# Altium schematic sheet template.SchDoc
size 840 x 594 mm; Address1: Address1; Address2: Address2; Address3: Address3; Address4: Address4; SheetNumber: 1; Scale: 1:1; Разраб.: Иванов; Обозначение документа: АБВГ.123456.001 Э3; Пров.: Петров; Утв.: Сидоров; Наименование организации: ОАО "Концерн "МПО-Гидроприбор"; Перв. применение: АБВГ.123456.000; Наименование изделия 1: Плата; Наименование изделия 2: Схема электрическая; Наименование изделия 3: принципиальная; Нач. отд.: Нач. отд.; Фамилия нач. отд.: Сидоров
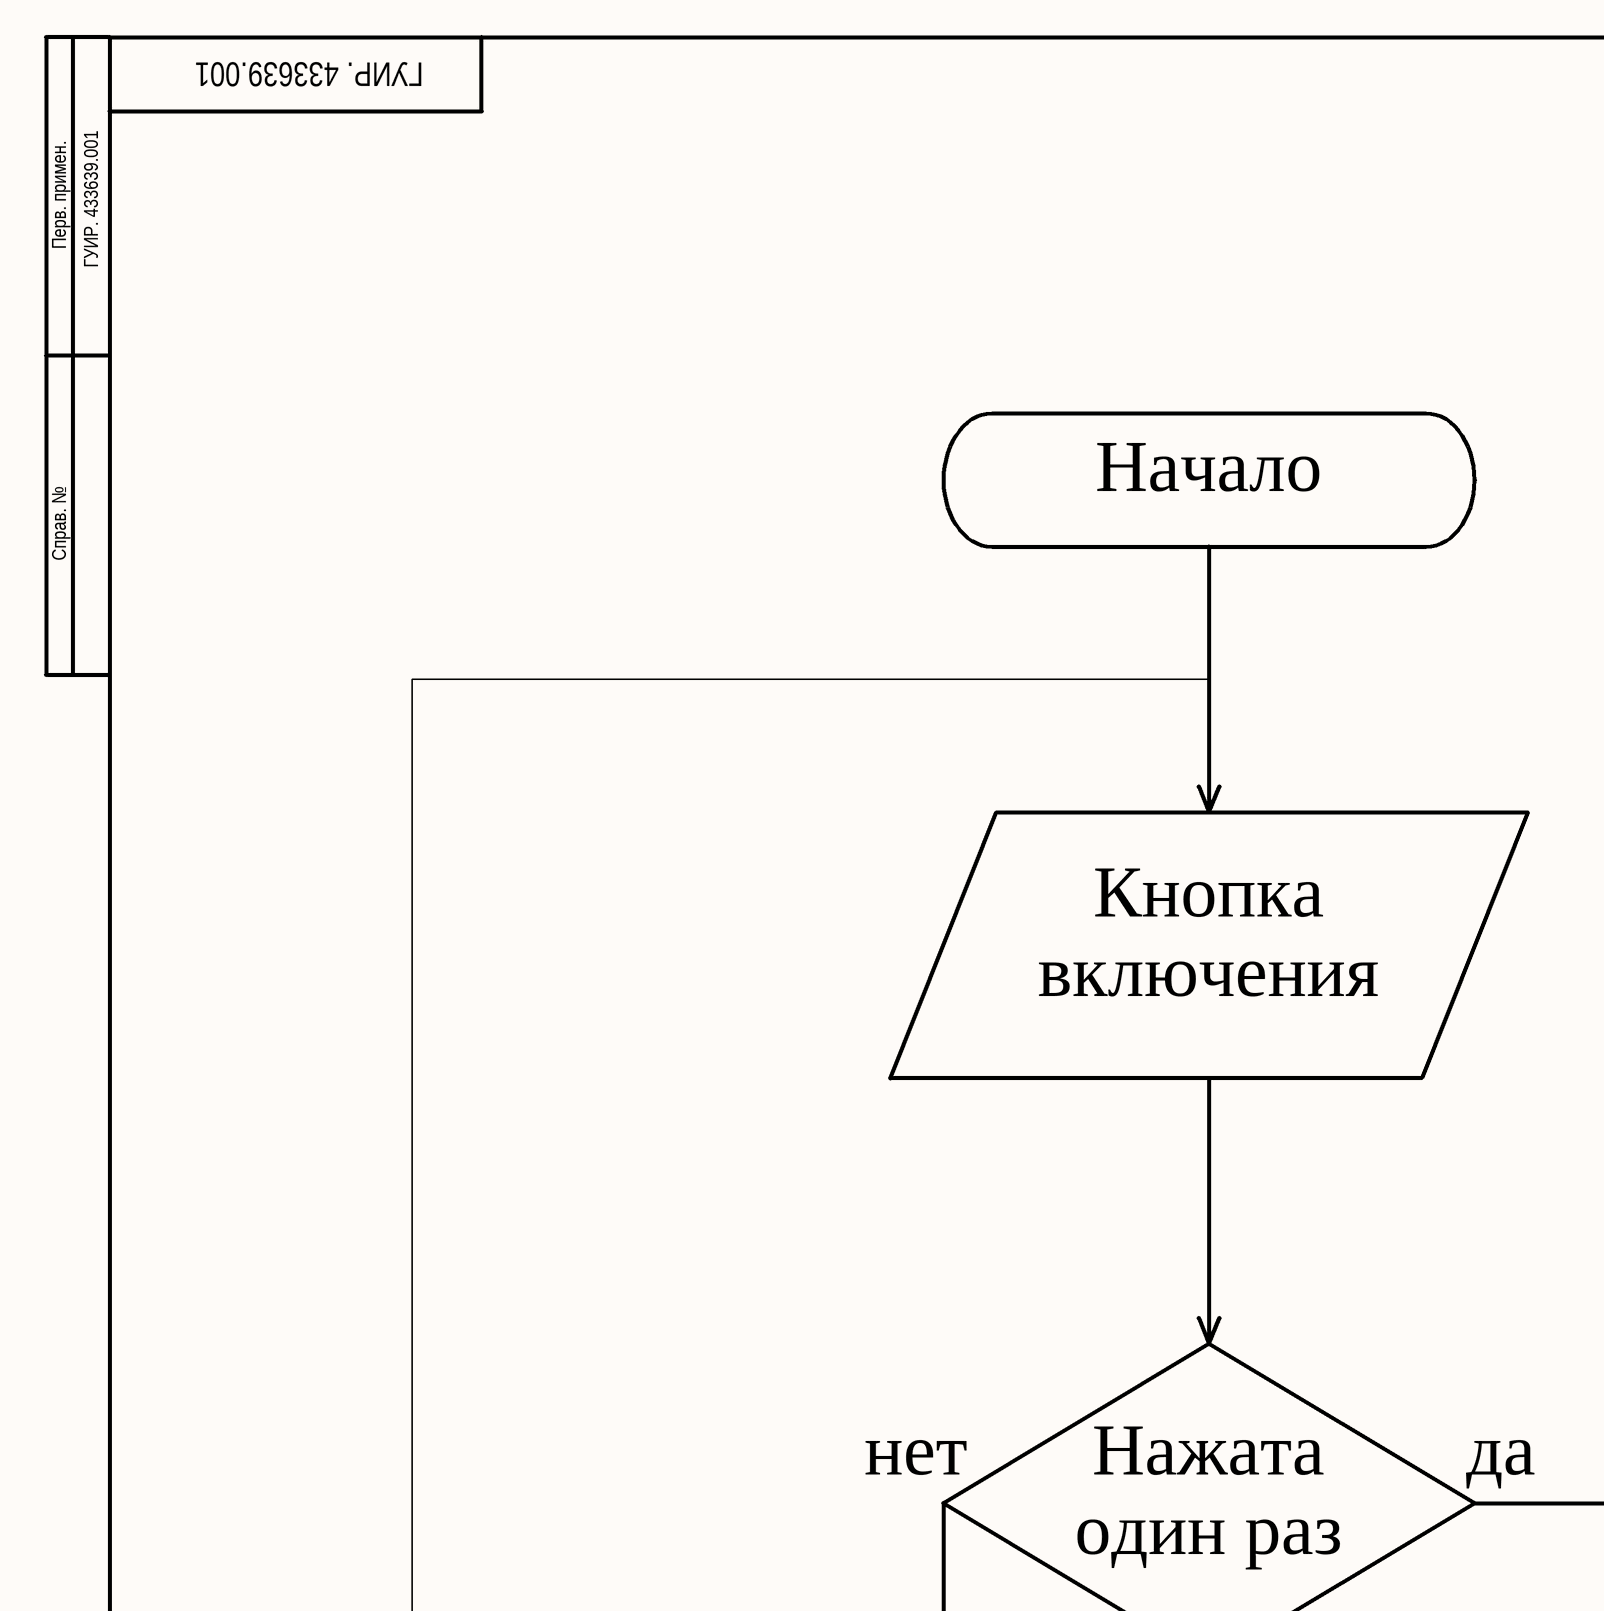
[diagram p0: template.SchDoc, top left]
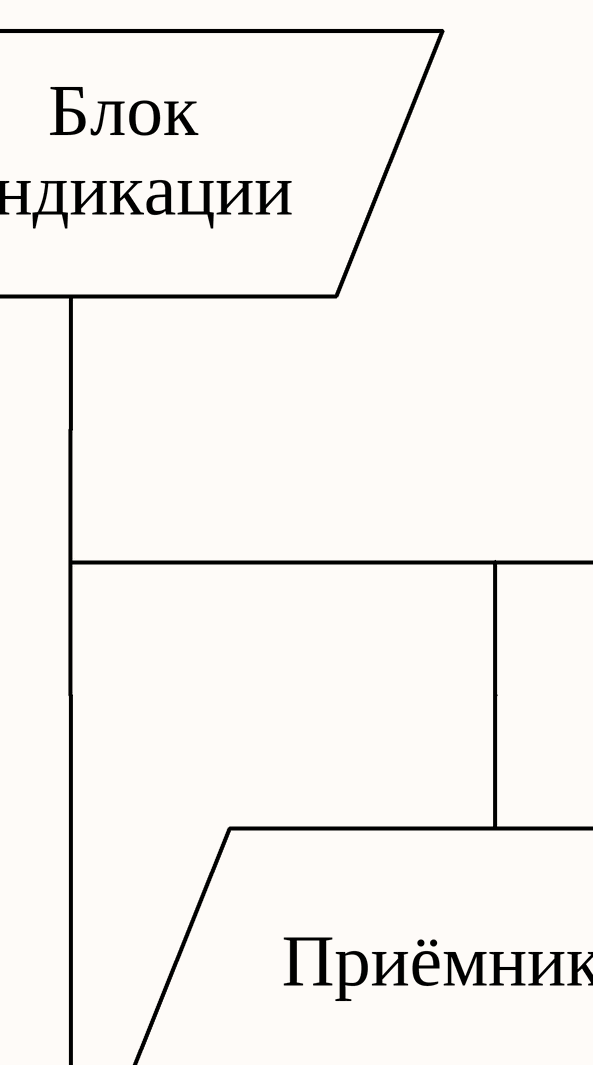
[diagram p1: template.SchDoc, top middle]
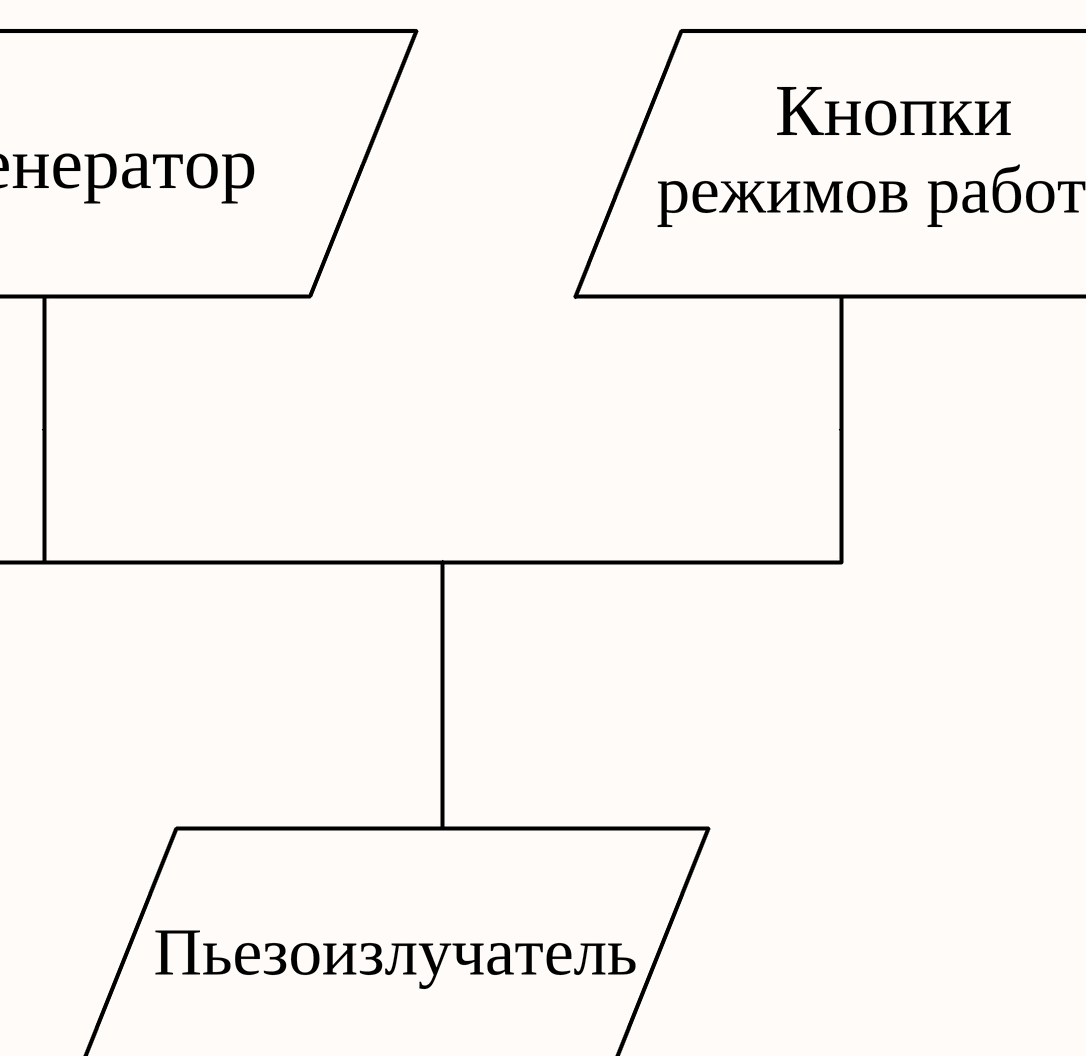
[diagram p2: template.SchDoc, top right]
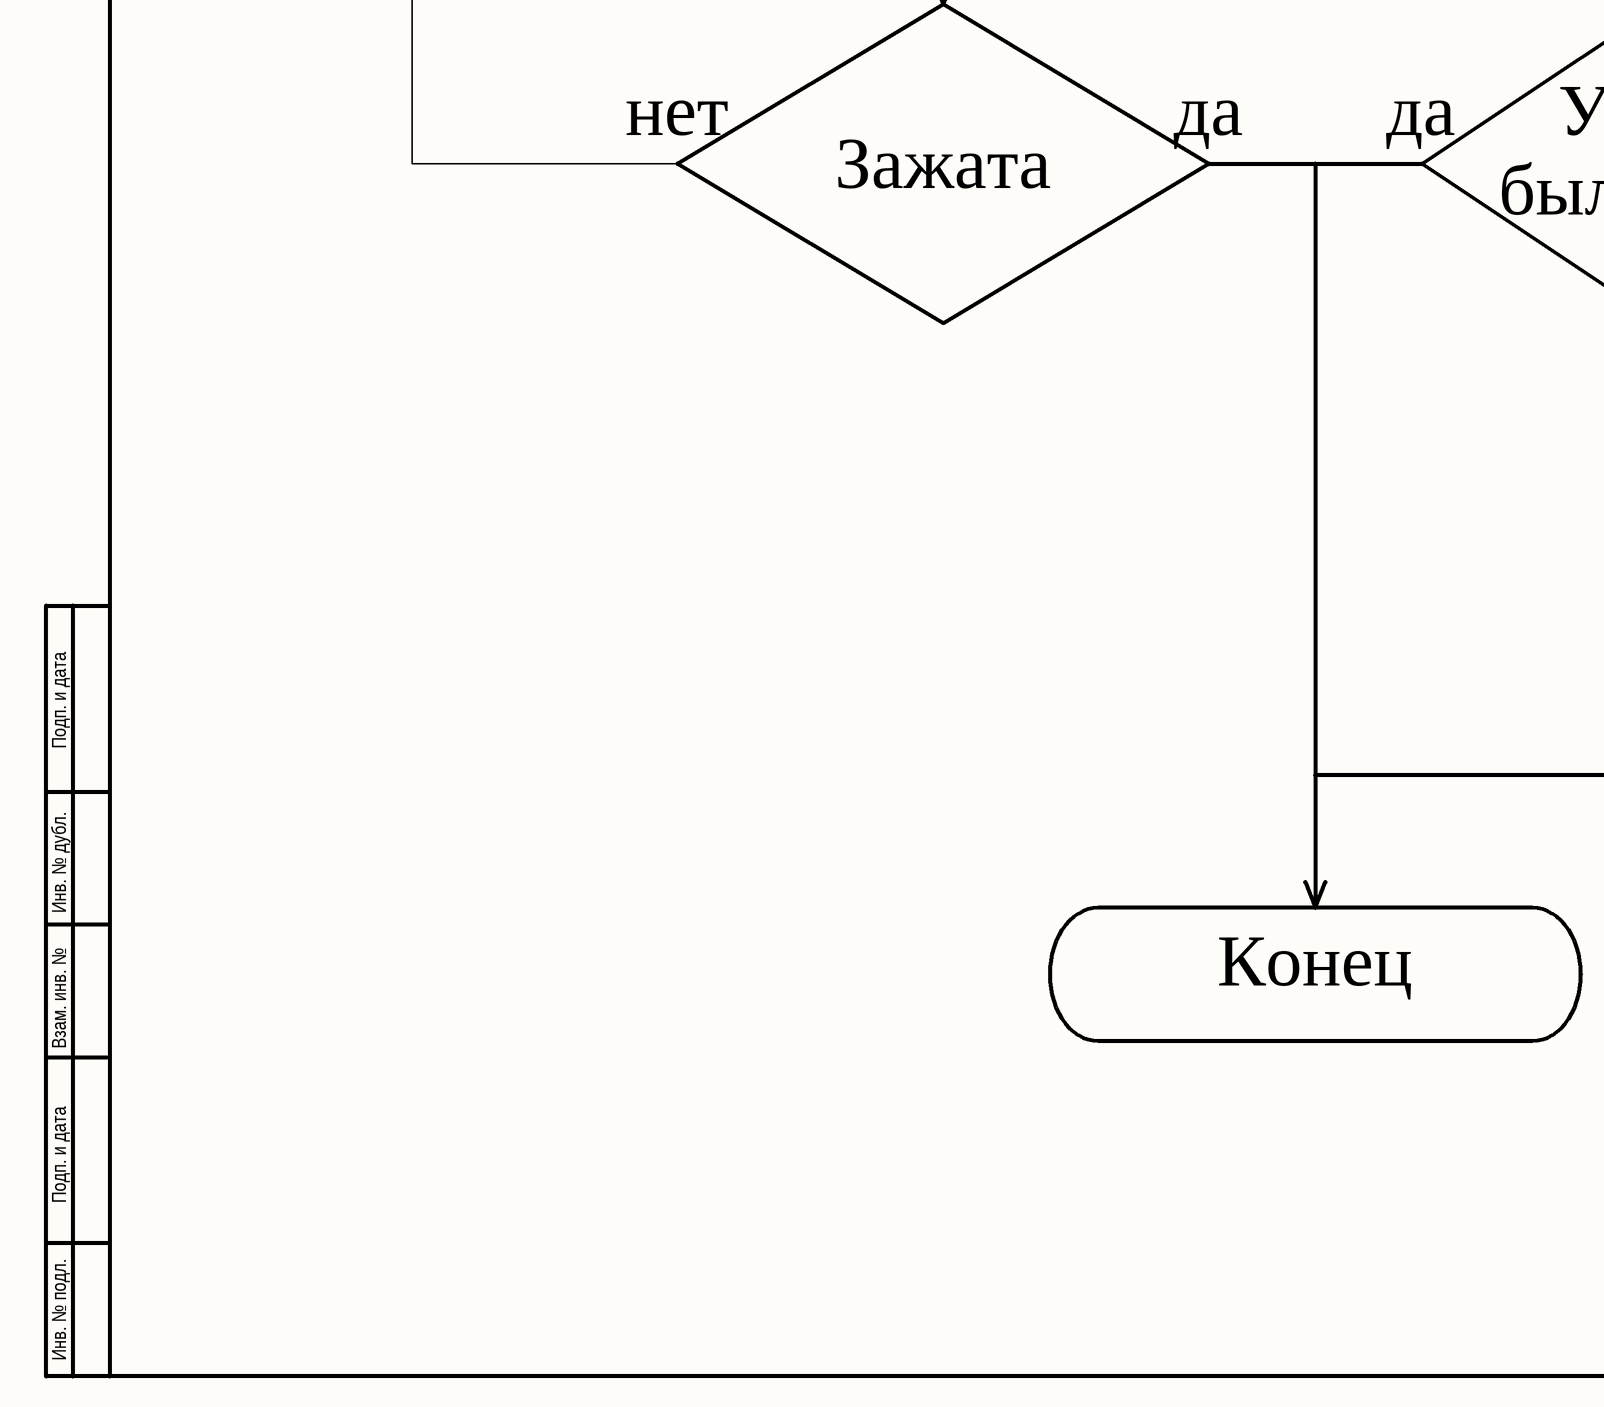
[diagram p3: template.SchDoc, bottom left]
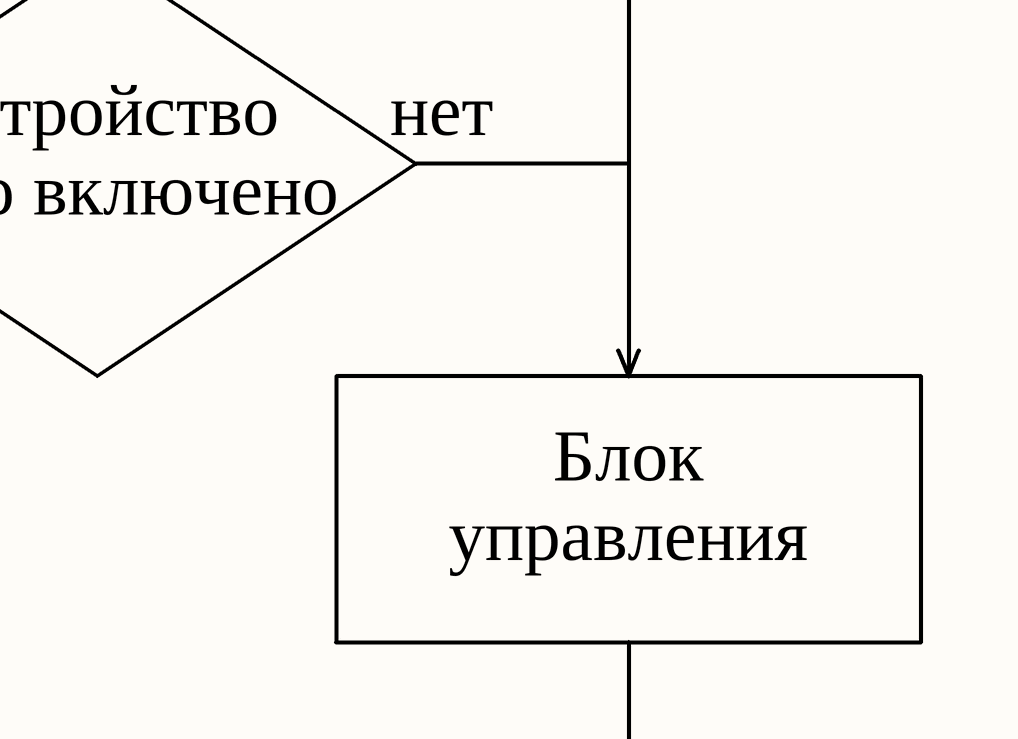
[diagram p4: template.SchDoc, bottom middle]
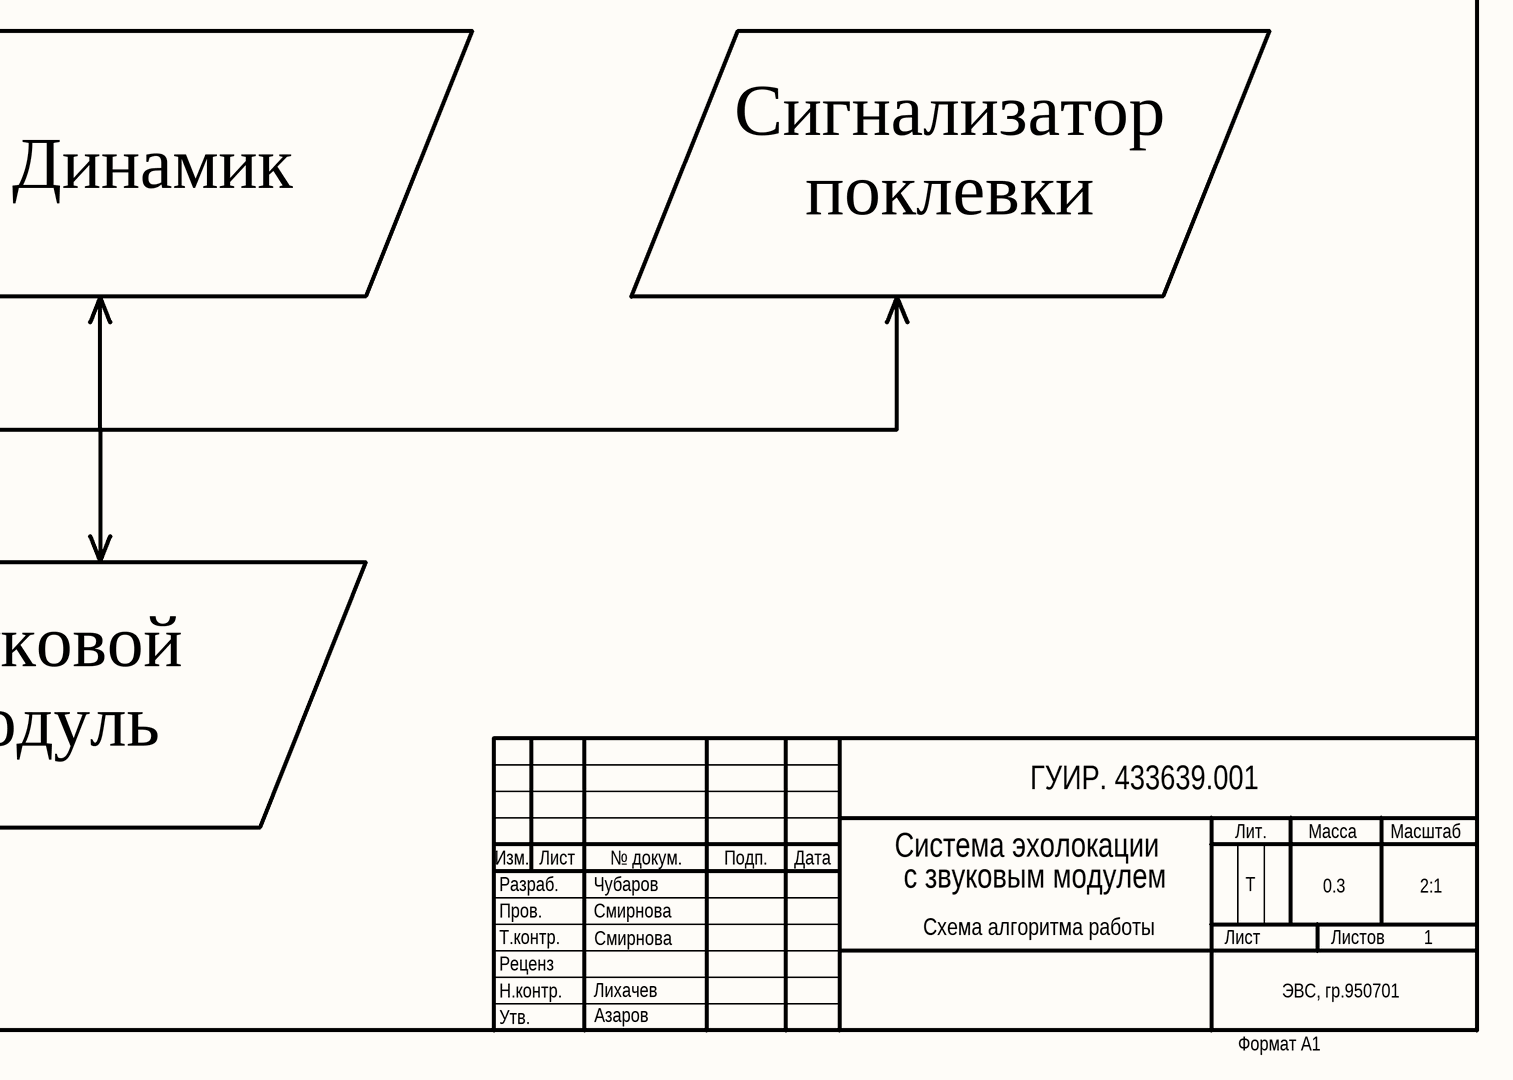
[diagram p5: template.SchDoc, bottom right]

## Notes on the sheet
- ГУИР. 433639.001
- Перв. примен.
- Начало
- Блок
- Кнопки
- Справ. №
- Генератор
- индикации
- режимов работы
- Кнопка
- включения
- Приёмник
- Пьезоизлучатель
- нет
- Нажата
- да
- один раз
- Устройство
- Зажата
- было включено
- Сигнализатор
- управления
- Динамик
- поклевки
- Подп. и дата
- Инв. № дубл.
- Конец
- Звуковой
- Взам. инв. №
- модуль
- Разраб.
- Изм.
- Лист
- Чубаров
- № докум.
- Подп.
- Дата
- Система эхолокации
- с звуковым модулем
- T
- Лит.
- Масса
- 0.3
- 2:1
- Масштаб
- Пров.
- Т.контр.
- Смирнова
- Схема алгоритма работы
- Листов
- 1
- Инв. № подл.
- Утв.
- Н.контр.
- Реценз
- Лихачев
- Азаров
- ЭВС, гр.950701
- Формат А1